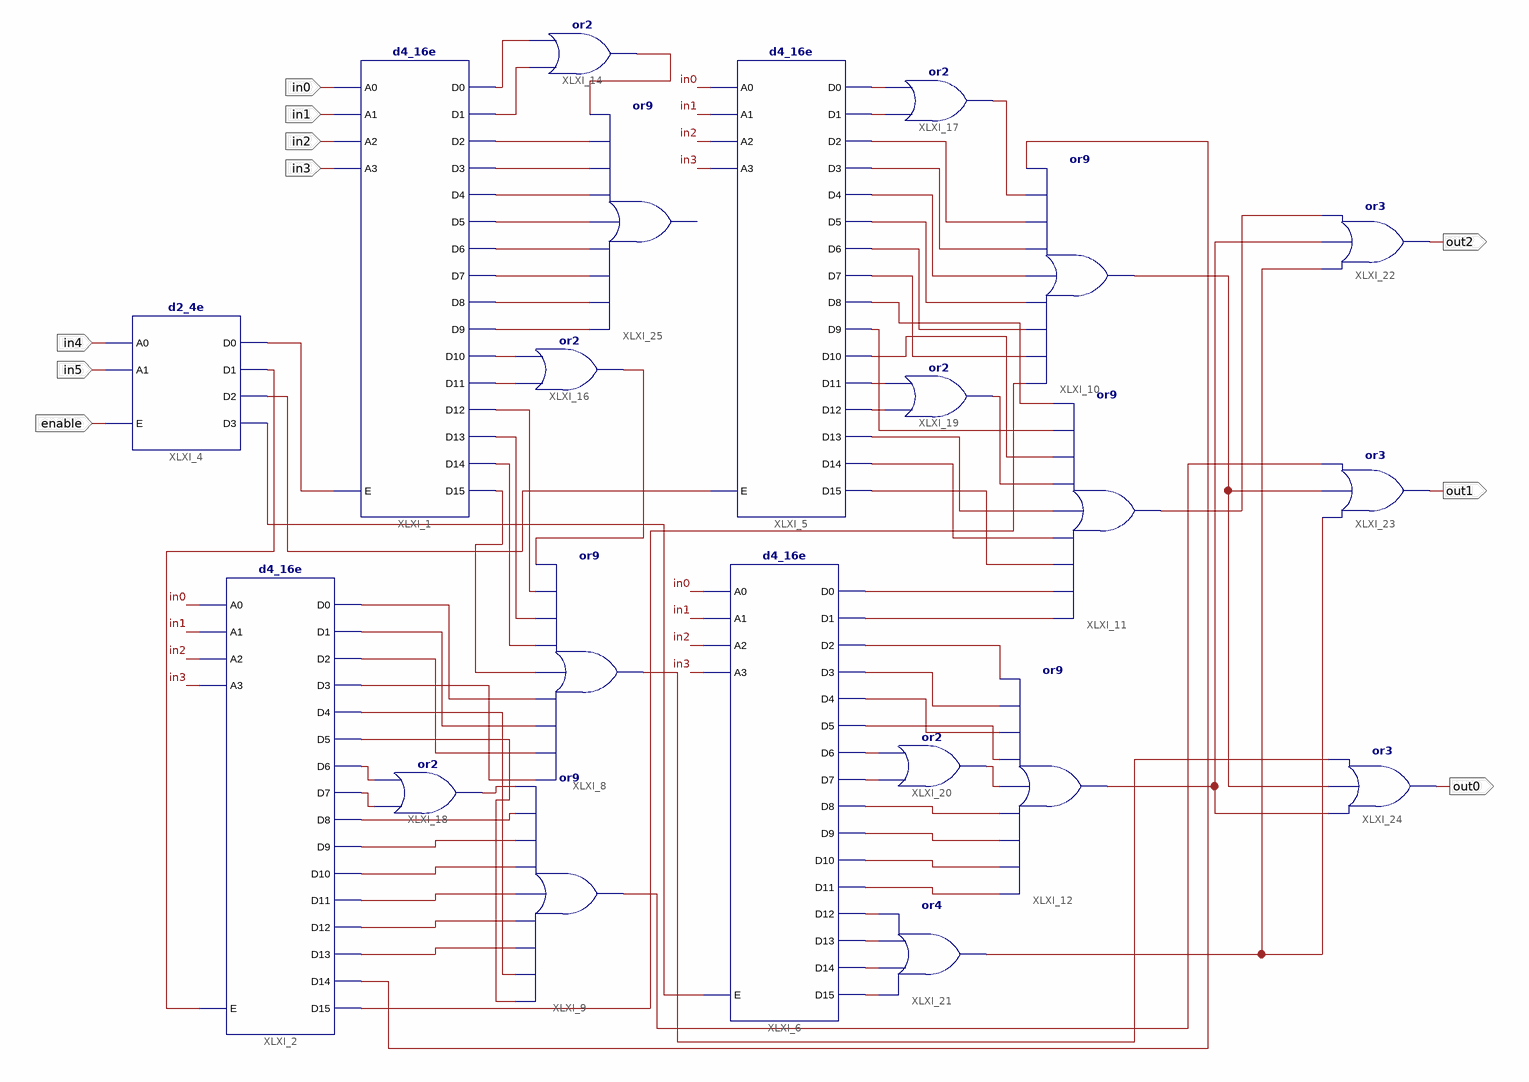
[diagram p0: schematic sheet 1]
// Xilinx ISE schematic Bin_to_Dec.sch (spartan3e) as structural Verilog: 21 symbols, 10 ports
module Bin_to_Dec (
  input  enable,
  input  in4,
  input  in5,
  input  in1,
  input  in2,
  input  in3,
  input  in0,
  output out2,
  output out1,
  output out0
);

  wire XLXN_1, XLXN_2, XLXN_11, XLXN_13, XLXN_14, XLXN_15, XLXN_16, XLXN_17, XLXN_19, XLXN_20, XLXN_25,
       XLXN_26, XLXN_29, XLXN_30, XLXN_33, XLXN_34, XLXN_35, XLXN_37, XLXN_38, XLXN_39, XLXN_40, XLXN_41,
       XLXN_42, XLXN_43, XLXN_44, XLXN_45, XLXN_46, XLXN_47, XLXN_52, XLXN_53, XLXN_54, XLXN_55, XLXN_56,
       XLXN_59, XLXN_60, XLXN_61, XLXN_62, XLXN_63, XLXN_64, XLXN_65, XLXN_68, XLXN_69, XLXN_70, XLXN_71,
       XLXN_72, XLXN_73, XLXN_74, XLXN_75, XLXN_76, XLXN_77, XLXN_78, XLXN_80, XLXN_81, XLXN_82, XLXN_83,
       XLXN_84, XLXN_85, XLXN_86, XLXN_88, XLXN_89, XLXN_90, XLXN_91, XLXN_92, XLXN_93, XLXN_94, XLXN_95,
       XLXN_97, XLXN_98, XLXN_99, XLXN_100, XLXN_101, XLXN_102, XLXN_103, XLXN_104, XLXN_105, XLXN_107,
       XLXN_109, XLXN_110, XLXN_114, XLXN_143;

  d4_16e XLXI_1 (
    .A0(in0), .A1(in1), .A2(in2), .A3(in3), .E(XLXN_1), .D0(XLXN_33), .D1(XLXN_34), .D10(XLXN_15),
    .D11(XLXN_14), .D12(XLXN_45), .D13(XLXN_46), .D14(XLXN_47), .D15(XLXN_52), .D2(XLXN_35), .D3(XLXN_37),
    .D4(XLXN_38), .D5(XLXN_39), .D6(XLXN_40), .D7(XLXN_41), .D8(XLXN_42), .D9(XLXN_43));
  d4_16e XLXI_2 (
    .A0(in0), .A1(in1), .A2(in2), .A3(in3), .E(XLXN_2), .D0(XLXN_53), .D1(XLXN_54), .D10(XLXN_62),
    .D11(XLXN_63), .D12(XLXN_64), .D13(XLXN_65), .D14(XLXN_70), .D15(XLXN_71), .D2(XLXN_55), .D3(XLXN_56),
    .D4(XLXN_68), .D5(XLXN_69), .D6(XLXN_20), .D7(XLXN_19), .D8(XLXN_60), .D9(XLXN_61));
  d2_4e XLXI_4 (.A0(in4), .A1(in5), .E(enable), .D0(XLXN_1), .D1(XLXN_2), .D2(XLXN_13), .D3(XLXN_11));
  d4_16e XLXI_5 (
    .A0(in0), .A1(in1), .A2(in2), .A3(in3), .E(XLXN_13), .D0(XLXN_17), .D1(XLXN_16), .D10(XLXN_82),
    .D11(XLXN_26), .D12(XLXN_25), .D13(XLXN_84), .D14(XLXN_85), .D15(XLXN_86), .D2(XLXN_73), .D3(XLXN_74),
    .D4(XLXN_75), .D5(XLXN_76), .D6(XLXN_77), .D7(XLXN_78), .D8(XLXN_80), .D9(XLXN_81));
  d4_16e XLXI_6 (
    .A0(in0), .A1(in1), .A2(in2), .A3(in3), .E(XLXN_11), .D0(XLXN_88), .D1(XLXN_89), .D10(XLXN_98),
    .D11(XLXN_99), .D12(XLXN_103), .D13(XLXN_102), .D14(XLXN_101), .D15(XLXN_100), .D2(XLXN_90),
    .D3(XLXN_91), .D4(XLXN_92), .D5(XLXN_93), .D6(XLXN_30), .D7(XLXN_29), .D8(XLXN_95), .D9(XLXN_97));
  or XLXI_8 (XLXN_104, XLXN_56, XLXN_55, XLXN_54, XLXN_53, XLXN_52, XLXN_47, XLXN_46, XLXN_45, XLXN_44);
  or XLXI_9 (XLXN_105, XLXN_69, XLXN_68, XLXN_65, XLXN_64, XLXN_63, XLXN_62, XLXN_61, XLXN_60, XLXN_59);
  or XLXI_10 (XLXN_107, XLXN_71, XLXN_78, XLXN_77, XLXN_76, XLXN_75, XLXN_74, XLXN_73, XLXN_72, XLXN_70);
  or XLXI_11 (XLXN_109, XLXN_89, XLXN_88, XLXN_86, XLXN_85, XLXN_84, XLXN_83, XLXN_82, XLXN_81, XLXN_80);
  or XLXI_12 (XLXN_110, XLXN_99, XLXN_98, XLXN_97, XLXN_95, XLXN_94, XLXN_93, XLXN_92, XLXN_91, XLXN_90);
  or XLXI_14 (XLXN_143, XLXN_34, XLXN_33);
  or XLXI_16 (XLXN_44, XLXN_14, XLXN_15);
  or XLXI_17 (XLXN_72, XLXN_16, XLXN_17);
  or XLXI_18 (XLXN_59, XLXN_19, XLXN_20);
  or XLXI_19 (XLXN_83, XLXN_25, XLXN_26);
  or XLXI_20 (XLXN_94, XLXN_29, XLXN_30);
  or XLXI_21 (XLXN_114, XLXN_100, XLXN_101, XLXN_102, XLXN_103);
  or XLXI_22 (out2, XLXN_114, XLXN_110, XLXN_109);
  or XLXI_23 (out1, XLXN_114, XLXN_107, XLXN_105);
  or XLXI_24 (out0, XLXN_110, XLXN_107, XLXN_104);
  // or9 XLXI_25 has open pins: I0=XLXN_43, I1=XLXN_42, I2=XLXN_41, I3=XLXN_40, I4=XLXN_39, I5=XLXN_38, I6=XLXN_37, I7=XLXN_35, I8=XLXN_143, O=open
endmodule
